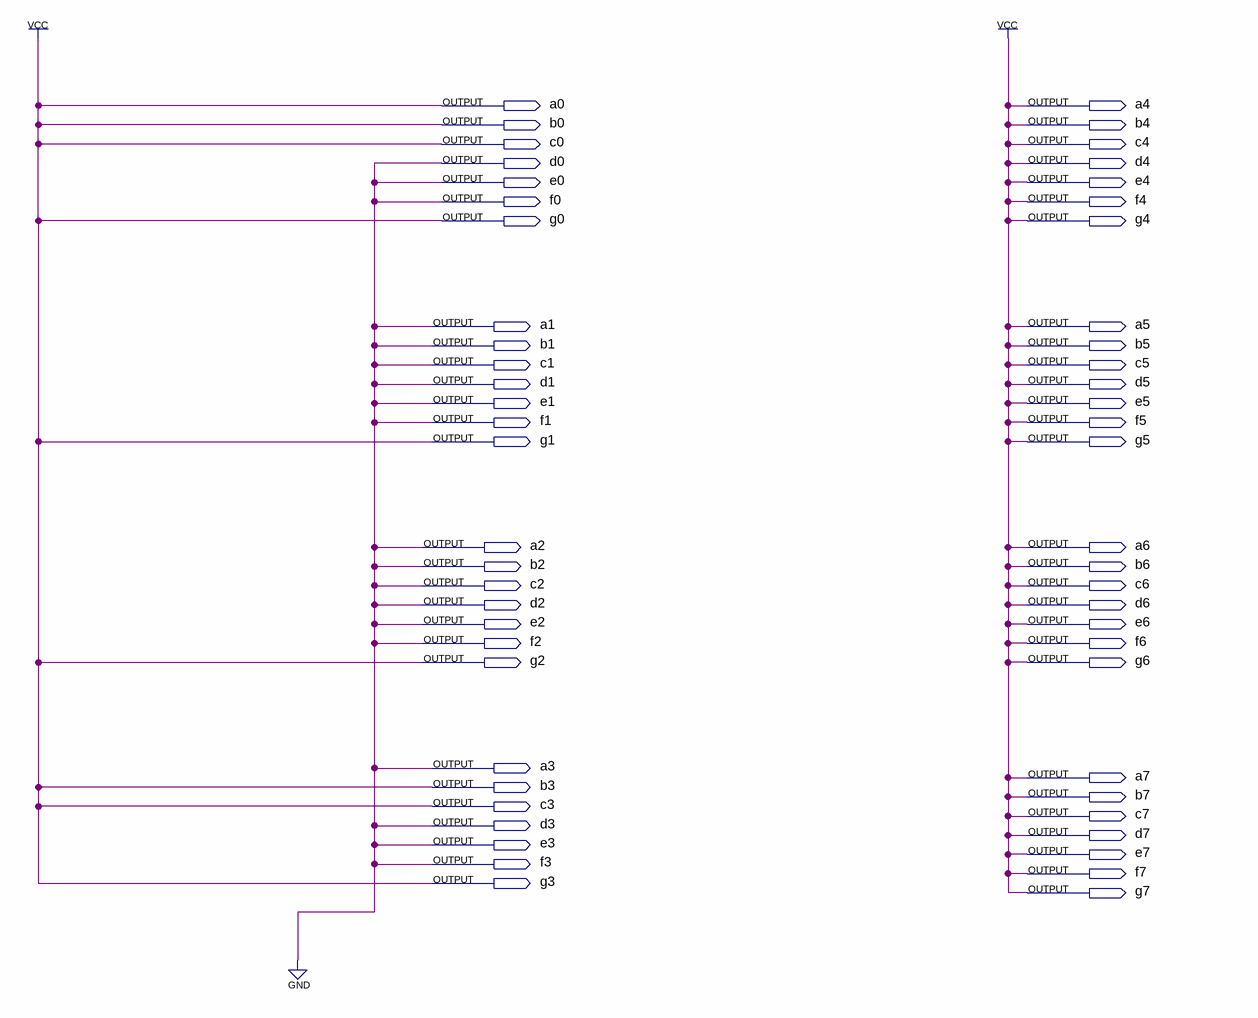
[diagram p0: schematic sheet]
// Quartus schematic design2.bdf as structural Verilog: 0 symbols, 56 pins
module design2 (
  output a0,
  output a4,
  output b0,
  output b4,
  output c0,
  output c4,
  output d0,
  output d4,
  output e0,
  output e4,
  output f0,
  output f4,
  output g0,
  output g4,
  output a1,
  output a5,
  output b1,
  output b5,
  output c1,
  output c5,
  output d1,
  output d5,
  output e1,
  output e5,
  output f1,
  output f5,
  output g1,
  output g5,
  output a2,
  output a6,
  output b2,
  output b6,
  output c2,
  output c6,
  output d2,
  output d6,
  output e2,
  output e6,
  output f2,
  output f6,
  output g2,
  output g6,
  output a3,
  output a7,
  output b3,
  output b7,
  output c3,
  output c7,
  output d3,
  output d7,
  output e3,
  output e7,
  output f3,
  output f7,
  output g3,
  output g7
);


  assign a0 = 1'b1;
  assign a1 = 1'b0;
  assign a2 = 1'b0;
  assign a3 = 1'b0;
  assign a4 = 1'b1;
  assign a5 = 1'b1;
  assign a6 = 1'b1;
  assign a7 = 1'b1;
  assign b0 = 1'b1;
  assign b1 = 1'b0;
  assign b2 = 1'b0;
  assign b3 = 1'b1;
  assign b4 = 1'b1;
  assign b5 = 1'b1;
  assign b6 = 1'b1;
  assign b7 = 1'b1;
  assign c0 = 1'b1;
  assign c1 = 1'b0;
  assign c2 = 1'b0;
  assign c3 = 1'b1;
  assign c4 = 1'b1;
  assign c5 = 1'b1;
  assign c6 = 1'b1;
  assign c7 = 1'b1;
  assign d0 = 1'b0;
  assign d1 = 1'b0;
  assign d2 = 1'b0;
  assign d3 = 1'b0;
  assign d4 = 1'b1;
  assign d5 = 1'b1;
  assign d6 = 1'b1;
  assign d7 = 1'b1;
  assign e0 = 1'b0;
  assign e1 = 1'b0;
  assign e2 = 1'b0;
  assign e3 = 1'b0;
  assign e4 = 1'b1;
  assign e5 = 1'b1;
  assign e6 = 1'b1;
  assign e7 = 1'b1;
  assign f0 = 1'b0;
  assign f1 = 1'b0;
  assign f2 = 1'b0;
  assign f3 = 1'b0;
  assign f4 = 1'b1;
  assign f5 = 1'b1;
  assign f6 = 1'b1;
  assign f7 = 1'b1;
  assign g0 = 1'b1;
  assign g1 = 1'b1;
  assign g2 = 1'b1;
  assign g3 = 1'b1;
  assign g4 = 1'b1;
  assign g5 = 1'b1;
  assign g6 = 1'b1;
  assign g7 = 1'b1;
endmodule
